# Altium schematic sheet IN-14 VALVE x2.SchDoc
size A4; SheetNumber: 4; SheetTotal: 9
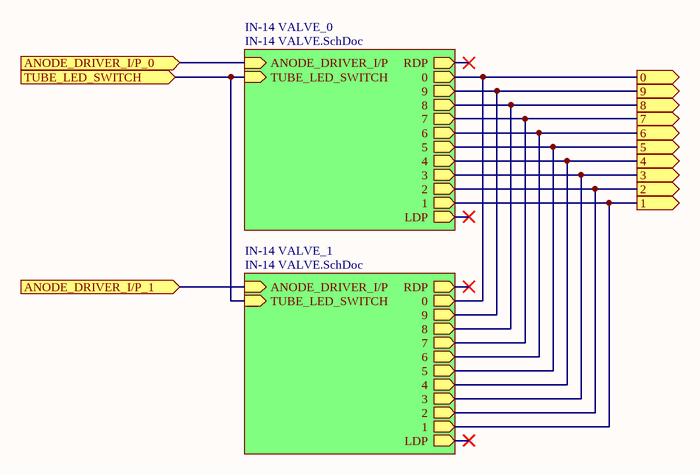
[diagram p0: IN-14 VALVE x2.SchDoc]

## Parts
?  (no value)

## Sub-sheets
IN-14 VALVE_0 = IN-14 VALVE.SchDoc: ANODE_DRIVER_I/P (in), RDP (out), 0 (out), 9 (out), 8 (out), 7 (out), 6 (out), 5 (out), 4 (out), 3 (out), 2 (out), 1 (out), LDP (out), TUBE_LED_SWITCH (in)
IN-14 VALVE_1 = IN-14 VALVE.SchDoc: ANODE_DRIVER_I/P (in), RDP (out), 0 (out), 9 (out), 8 (out), 7 (out), 6 (out), 5 (out), 4 (out), 3 (out), 2 (out), 1 (out), LDP (out), TUBE_LED_SWITCH (in)

## Ports
0 (out), 1 (out), 2 (out), 3 (out), 4 (out), 5 (out), 6 (out), 7 (out), 8 (out), 9 (out), ANODE_DRIVER_I/P_0 (in), ANODE_DRIVER_I/P_1 (in), TUBE_LED_SWITCH (in)

## Nets
0: port 0, sheet IN-14 VALVE_0/0, sheet IN-14 VALVE_1/0
1: port 1, sheet IN-14 VALVE_0/1, sheet IN-14 VALVE_1/1
2: port 2, sheet IN-14 VALVE_0/2, sheet IN-14 VALVE_1/2
3: port 3, sheet IN-14 VALVE_0/3, sheet IN-14 VALVE_1/3
4: port 4, sheet IN-14 VALVE_0/4, sheet IN-14 VALVE_1/4
5: port 5, sheet IN-14 VALVE_0/5, sheet IN-14 VALVE_1/5
6: port 6, sheet IN-14 VALVE_0/6, sheet IN-14 VALVE_1/6
7: port 7, sheet IN-14 VALVE_0/7, sheet IN-14 VALVE_1/7
8: port 8, sheet IN-14 VALVE_0/8, sheet IN-14 VALVE_1/8
9: port 9, sheet IN-14 VALVE_0/9, sheet IN-14 VALVE_1/9
ANODE_DRIVER_I/P_0: port ANODE_DRIVER_I/P_0, sheet IN-14 VALVE_0/ANODE_DRIVER_I/P
ANODE_DRIVER_I/P_1: port ANODE_DRIVER_I/P_1, sheet IN-14 VALVE_1/ANODE_DRIVER_I/P
TUBE_LED_SWITCH: port TUBE_LED_SWITCH, sheet IN-14 VALVE_0/TUBE_LED_SWITCH, sheet IN-14 VALVE_1/TUBE_LED_SWITCH

## Notes on the sheet
- Project:
- Designer:
- Sheet
- of
- Filename:

## Library data of the parts
? = CMP-00003-4: The KETS Schematic Sheet Title Block